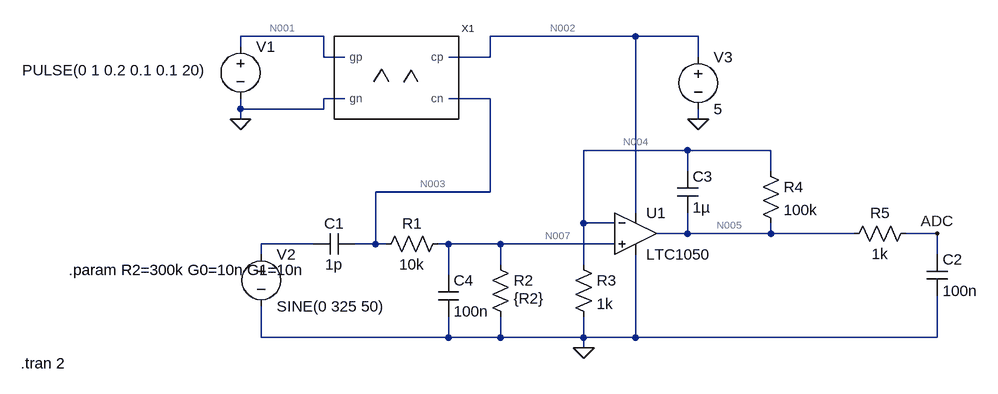
[diagram p0: schematic TransimpedanceAmpStage.asc]
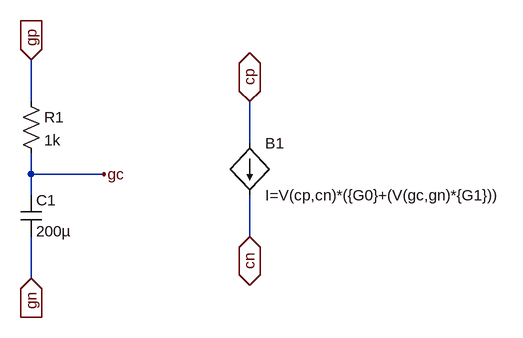
[diagram p1: sub-circuit gassensor.asc]
TransimpedanceAmpStage.asc, the LTspice schematic file:
Version 4
SHEET 1 1444 680
WIRE 96 -256 -32 -256
WIRE 576 -256 352 -256
WIRE 672 -256 576 -256
WIRE -32 -240 -32 -256
WIRE 96 -224 96 -256
WIRE 128 -224 96 -224
WIRE 352 -224 352 -256
WIRE 352 -224 288 -224
WIRE 672 -224 672 -256
WIRE 128 -160 96 -160
WIRE 352 -160 288 -160
WIRE -32 -144 -32 -160
WIRE 96 -144 96 -160
WIRE 96 -144 -32 -144
WIRE -32 -128 -32 -144
WIRE 672 -128 672 -144
WIRE 656 -80 496 -80
WIRE 784 -80 656 -80
WIRE 656 -48 656 -80
WIRE 784 -48 784 -80
WIRE 352 -16 352 -160
WIRE 352 -16 176 -16
WIRE 576 16 576 -256
WIRE 496 32 496 -80
WIRE 544 32 496 32
WIRE 656 48 656 16
WIRE 656 48 608 48
WIRE 784 48 784 32
WIRE 784 48 656 48
WIRE 912 48 784 48
WIRE 1040 48 992 48
WIRE 80 64 0 64
WIRE 176 64 176 -16
WIRE 176 64 144 64
WIRE 192 64 176 64
WIRE 288 64 272 64
WIRE 368 64 288 64
WIRE 544 64 368 64
WIRE 0 80 0 64
WIRE 1040 80 1040 48
WIRE 368 96 368 64
WIRE 496 96 496 32
WIRE 288 112 288 64
WIRE 0 208 0 160
WIRE 288 208 288 176
WIRE 288 208 0 208
WIRE 368 208 368 176
WIRE 368 208 288 208
WIRE 496 208 496 176
WIRE 496 208 368 208
WIRE 576 208 576 80
WIRE 576 208 496 208
WIRE 1040 208 1040 144
WIRE 1040 208 576 208
WIRE 496 224 496 208
FLAG 496 224 0
FLAG 672 -128 0
FLAG -32 -128 0
FLAG 1040 48 ADC
SYMBOL cap 144 48 R90
WINDOW 0 0 32 VBottom 2
WINDOW 3 32 32 VTop 2
SYMATTR InstName C1
SYMATTR Value 1p
SYMBOL res 288 48 R90
WINDOW 0 0 56 VBottom 2
WINDOW 3 32 56 VTop 2
SYMATTR InstName R1
SYMATTR Value 10k
SYMBOL res 352 80 R0
WINDOW 3 36 68 Left 2
SYMATTR InstName R2
SYMATTR Value {R2}
SYMBOL res 480 80 R0
SYMATTR InstName R3
SYMATTR Value 1k
SYMBOL cap 1024 80 R0
SYMATTR InstName C2
SYMATTR Value 100n
SYMBOL cap 640 -48 R0
SYMATTR InstName C3
SYMATTR Value 1µ
SYMBOL res 768 -64 R0
SYMATTR InstName R4
SYMATTR Value 100k
SYMBOL res 1008 32 R90
WINDOW 0 0 56 VBottom 2
WINDOW 3 32 56 VTop 2
SYMATTR InstName R5
SYMATTR Value 1k
SYMBOL GasSensor 208 -192 R0
SYMATTR InstName X1
SYMBOL OpAmps\\LTC1050 576 -16 R0
SYMATTR InstName U1
SYMBOL voltage -32 -256 R0
WINDOW 3 -336 52 Left 2
WINDOW 123 0 0 Left 0
WINDOW 39 0 0 Left 0
SYMATTR InstName V1
SYMATTR Value PULSE(0 1 0.2 0.1 0.1 20)
SYMBOL voltage 0 64 R0
WINDOW 123 0 0 Left 0
WINDOW 39 0 0 Left 0
SYMATTR InstName V2
SYMATTR Value SINE(0 325 50)
SYMBOL cap 272 112 R0
SYMATTR InstName C4
SYMATTR Value 100n
SYMBOL voltage 672 -240 R0
WINDOW 123 0 0 Left 0
WINDOW 39 0 0 Left 0
SYMATTR InstName V3
SYMATTR Value 5
TEXT -370 248 Left 2 !.tran 2
TEXT -296 104 Left 2 !.param R2=300k G0=10n G1=10n

gassensor.asc, the sub-circuit schematic file:
Version 4
SHEET 1 880 680
WIRE -64 -48 -64 -112
WIRE 272 16 272 -48
WIRE -64 64 -64 32
WIRE 48 64 -64 64
WIRE -64 96 -64 64
WIRE 272 160 272 96
WIRE -64 224 -64 160
FLAG -64 -112 gp
IOPIN -64 -112 In
FLAG -64 224 gn
IOPIN -64 224 In
FLAG 272 -48 cp
IOPIN 272 -48 BiDir
FLAG 272 160 cn
IOPIN 272 160 BiDir
FLAG 48 64 gc
SYMBOL res -80 -64 R0
SYMATTR InstName R1
SYMATTR Value 1k
SYMBOL cap -80 96 R0
SYMATTR InstName C1
SYMATTR Value 200µ
SYMBOL bi 272 16 R0
SYMATTR InstName B1
SYMATTR Value I=V(cp,cn)*({G0}+(V(gc,gn)*{G1}))

The netlist it stands for:
* TransimpedanceAmpStage.asc
C1 N003 N006 1p
R1 N007 N003 10k
R2 N007 0 {R2}
R3 N004 0 1k
C2 ADC 0 100n
C3 N004 N005 1µ
R4 N004 N005 100k
R5 ADC N005 1k
XX1 N001 0 N002 N003 gassensor
XU1 N007 N004 N002 0 N005 LTC1050  ; pins In+ In- V+ V- OUT
V1 N001 0 PULSE(0 1 0.2 0.1 0.1 20)
V2 N006 0 SINE(0 325 50)
C4 N007 0 100n
V3 N002 0 5

* block symbol definitions
.subckt gassensor gp gn cp cn
R1 gp gc 1k
C1 gc gn 200µ
B1 cp cn I=V(cp,cn)*({G0}+(V(gc,gn)*{G1}))
.ends gassensor

.tran 2
.param R2=300k G0=10n G1=10n
.lib LTC.lib
.backanno
.end

* Results of the author's LTspice run, read from the files saved beside the schematic
* Operating Point, zero values left out:
*   V(n003) = 15.45 mV
*   V(n007) = 14.95 mV
*   V(n004) = 14.95 mV
*   V(adc) = 1.51 V
*   V(n005) = 1.51 V
*   V(n002) = 5 V
*   I(R4) = -14.95 µA
*   I(R3) = 14.95 µA
*   I(R2) = 49.85 nA
*   I(R1) = -49.85 nA
*   I(V3) = -759.2 µA
*   Ix(x1:CP) = 49.85 nA
*   Ix(x1:CN) = -49.85 nA
*   Ix(u1:3) = 759.1 µA
*   Ix(u1:4) = -744.2 µA
*   Ix(u1:5) = -14.95 µA
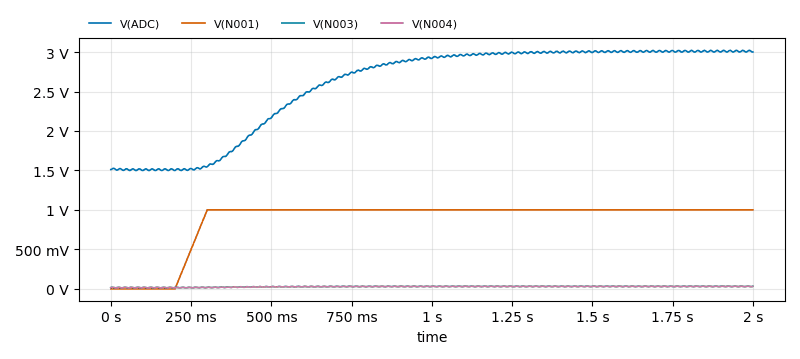
[diagram p2: Transient Analysis of TransimpedanceAmpStage.asc, plotted from the saved traces]
* Transient Analysis, 1 run:
*   V(ADC): min 1.499 V, max 3.021 V, average 2.577 V, rms 2.64 V, last 3.001 V
*   V(N001): min 0 V, max 1 V, average 875 mV, rms 930.9 mV, last 1 V
*   V(N003): min 11.78 mV, max 34.27 mV, average 27.13 mV, rms 27.8 mV, last 32.17 mV
*   V(N004): min 11.53 mV, max 33.03 mV, average 26.25 mV, rms 26.88 mV, last 30.15 mV